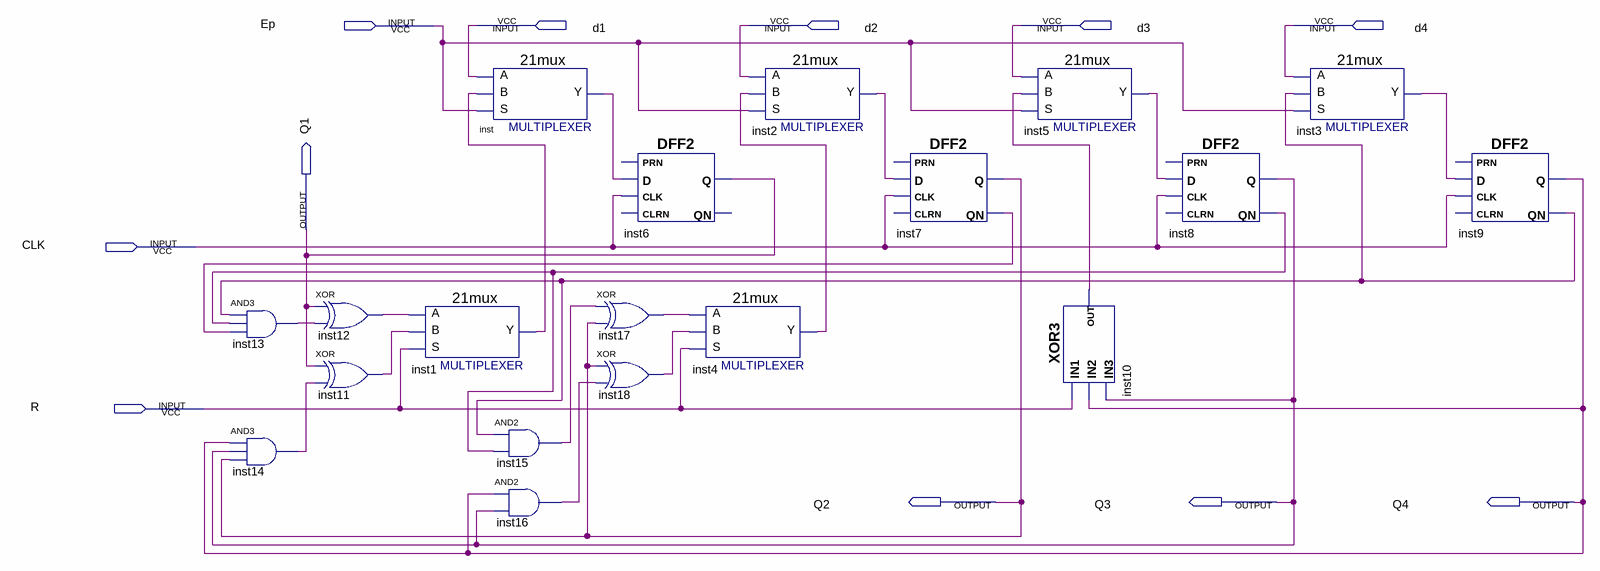
[diagram p0: schematic sheet]
// Quartus schematic q51.bdf as structural Verilog: 19 symbols, 11 pins
module q51 (
  input  Ep,
  input  d1,
  input  d2,
  input  d3,
  input  d4,
  input  CLK,
  input  R,
  output Q1,
  output Q2,
  output Q3,
  output Q4
);

  wire inst1_y, inst2_y, inst3_y, inst4_y, inst5_y, inst7_qn, inst8_qn, inst9_qn, inst10_out, inst11_out,
       inst12_out, inst13_out, inst14_out, inst15_out, inst16_out, inst17_out, inst18_out, inst_y;

  and inst13 (inst13_out, inst9_qn, inst8_qn, inst7_qn);
  and inst14 (inst14_out, Q4, Q3, Q2);
  xor inst12 (inst12_out, Q1, inst13_out);
  xor inst11 (inst11_out, Q1, inst14_out);
  \21mux  inst1 (.S(R), .B(inst11_out), .A(inst12_out), .Y(inst1_y));
  \21mux  inst (.S(Ep), .B(inst1_y), .A(d1), .Y(inst_y));
  and inst15 (inst15_out, inst9_qn, inst8_qn);
  and inst16 (inst16_out, Q4, Q3);
  xor inst17 (inst17_out, inst15_out, Q2);
  xor inst18 (inst18_out, Q2, inst16_out);
  DFF2 inst6 (.CLK(CLK), .D(inst_y), .Q(Q1));  // open: PRN, CLRN, QN
  \21mux  inst4 (.S(R), .B(inst18_out), .A(inst17_out), .Y(inst4_y));
  \21mux  inst2 (.S(Ep), .B(inst4_y), .A(d2), .Y(inst2_y));
  DFF2 inst7 (.CLK(CLK), .D(inst2_y), .Q(Q2), .QN(inst7_qn));  // open: PRN, CLRN
  \21mux  inst5 (.S(Ep), .B(inst10_out), .A(d3), .Y(inst5_y));
  XOR3 inst10 (.IN3(Q3), .IN1(R), .IN2(Q4), .OUT(inst10_out));
  DFF2 inst8 (.CLK(CLK), .D(inst5_y), .Q(Q3), .QN(inst8_qn));  // open: PRN, CLRN
  \21mux  inst3 (.S(Ep), .B(inst9_qn), .A(d4), .Y(inst3_y));
  DFF2 inst9 (.CLK(CLK), .D(inst3_y), .Q(Q4), .QN(inst9_qn));  // open: PRN, CLRN
endmodule
